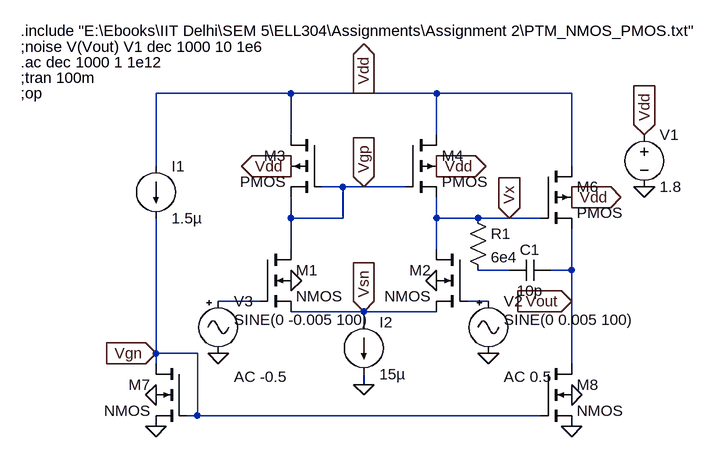
[diagram p0: schematic Q1.asc]
Q1.asc, the LTspice schematic file:
Version 4
SHEET 1 1108 680
WIRE 176 48 -32 48
WIRE 288 48 176 48
WIRE 400 48 288 48
WIRE 608 48 400 48
WIRE 176 112 176 48
WIRE 400 112 400 48
WIRE -32 160 -32 48
WIRE 608 160 608 48
WIRE 256 192 224 192
WIRE 288 192 256 192
WIRE 352 192 288 192
WIRE 176 240 176 208
WIRE 256 240 256 192
WIRE 256 240 176 240
WIRE 400 240 400 208
WIRE 464 240 400 240
WIRE 512 240 464 240
WIRE 560 240 512 240
WIRE 176 288 176 240
WIRE 400 288 400 240
WIRE 512 320 464 320
WIRE 608 320 608 256
WIRE 608 320 576 320
WIRE 128 368 64 368
WIRE 480 368 448 368
WIRE 608 368 608 320
WIRE 288 384 176 384
WIRE 400 384 288 384
WIRE 288 400 288 384
WIRE -32 448 -32 240
WIRE 32 448 -32 448
WIRE -32 464 -32 448
WIRE 608 464 608 368
WIRE 288 496 288 480
WIRE 32 544 32 448
WIRE 32 544 16 544
WIRE 560 544 32 544
FLAG 400 336 0
FLAG 176 336 0
FLAG 608 512 0
FLAG -32 512 0
FLAG 288 496 0
FLAG 176 160 Vdd
IOPIN 176 160 Out
FLAG 400 160 Vdd
IOPIN 400 160 Out
FLAG 608 208 Vdd
IOPIN 608 208 Out
FLAG 288 48 Vdd
IOPIN 288 48 Out
FLAG 608 560 0
FLAG -32 560 0
FLAG 608 368 Vout
IOPIN 608 368 In
FLAG 720 192 0
FLAG 720 112 Vdd
IOPIN 720 112 In
FLAG 64 448 0
FLAG 480 448 0
FLAG 512 240 Vx
IOPIN 512 240 In
FLAG 288 192 Vgp
IOPIN 288 192 In
FLAG 288 384 Vsn
IOPIN 288 384 In
FLAG -32 448 Vgn
IOPIN -32 448 In
SYMBOL nmos4 128 288 R0
SYMATTR InstName M1
SYMATTR Value2 l=0.5u w=2u
SYMBOL nmos4 448 288 M0
SYMATTR InstName M2
SYMATTR Value2 l=0.5u w=2u
SYMBOL pmos4 224 112 M0
SYMATTR InstName M3
SYMATTR Value2 l=0.5u w=2u
SYMBOL pmos4 352 112 R0
SYMATTR InstName M4
SYMATTR Value2 l=0.5u w=2u
SYMBOL pmos4 560 160 R0
SYMATTR InstName M6
SYMATTR Value2 l=0.5u w=2u
SYMBOL nmos4 16 464 M0
SYMATTR InstName M7
SYMATTR Value2 l=0.5u w=1u
SYMBOL nmos4 560 464 R0
SYMATTR InstName M8
SYMATTR Value2 l=0.5u w=5u
SYMBOL current -32 160 R0
WINDOW 123 0 0 Left 0
WINDOW 39 0 0 Left 0
SYMATTR InstName I1
SYMATTR Value 1.5µ
SYMBOL voltage 720 96 R0
WINDOW 123 0 0 Left 0
WINDOW 39 0 0 Left 0
SYMATTR InstName V1
SYMATTR Value 1.8
SYMBOL Misc\\signal 480 352 R0
WINDOW 123 24 132 Left 2
WINDOW 39 0 0 Left 0
WINDOW 3 24 44 Left 2
SYMATTR Value2 AC 0.5
SYMATTR Value SINE(0 0.005 100)
SYMATTR InstName V2
SYMBOL Misc\\signal 64 352 R0
WINDOW 123 24 132 Left 2
WINDOW 39 0 0 Left 0
WINDOW 3 24 44 Left 2
SYMATTR Value2 AC -0.5
SYMATTR Value SINE(0 -0.005 100)
SYMATTR InstName V3
SYMBOL current 288 400 R0
WINDOW 123 0 0 Left 0
WINDOW 39 0 0 Left 0
SYMATTR InstName I2
SYMATTR Value 15µ
SYMBOL res 448 224 R0
SYMATTR InstName R1
SYMATTR Value 6e4
SYMBOL cap 576 304 R90
WINDOW 0 0 32 VBottom 2
WINDOW 3 32 32 VTop 2
SYMATTR InstName C1
SYMATTR Value 10p
TEXT -240 -24 Left 2 !;noise V(Vout) V1 dec 1000 10 1e6
TEXT -240 -48 Left 2 !.include "E:\\Ebooks\\IIT Delhi\\SEM 5\\ELL304\\Assignments\\Assignment 2\\PTM_NMOS_PMOS.txt"
TEXT -240 0 Left 2 !.ac dec 1000 1 1e12
TEXT -240 24 Left 2 !;tran 100m
TEXT -240 48 Left 2 !;op

The netlist it stands for:
* Q1.asc
M1 Vgp N002 Vsn 0 NMOS l=0.5u w=2u
M2 Vx N003 Vsn 0 NMOS l=0.5u w=2u
M3 Vdd Vgp Vgp Vdd PMOS l=0.5u w=2u
M4 Vdd Vgp Vx Vdd PMOS l=0.5u w=2u
M6 Vdd Vx Vout Vdd PMOS l=0.5u w=2u
M7 Vgn Vgn 0 0 NMOS l=0.5u w=1u
M8 Vout Vgn 0 0 NMOS l=0.5u w=5u
I1 Vdd Vgn 1.5µ
V1 Vdd 0 1.8
V2 N003 0 SINE(0 0.005 100) AC 0.5
V3 N002 0 SINE(0 -0.005 100) AC -0.5
I2 Vsn 0 15µ
R1 Vx N001 6e4
C1 Vout N001 10p
.model NMOS NMOS
.model PMOS PMOS
.lib standard.mos
;noise V(Vout) V1 dec 1000 10 1e6
.include "E:\Ebooks\IIT Delhi\SEM 5\ELL304\Assignments\Assignment 2\PTM_NMOS_PMOS.txt"
.ac dec 1000 1 1e12
;tran 100m
;op
.backanno
.end